# Altium schematic sheet power_ic.SchDoc
size A4; SheetNumber: 2; SheetTotal: 4
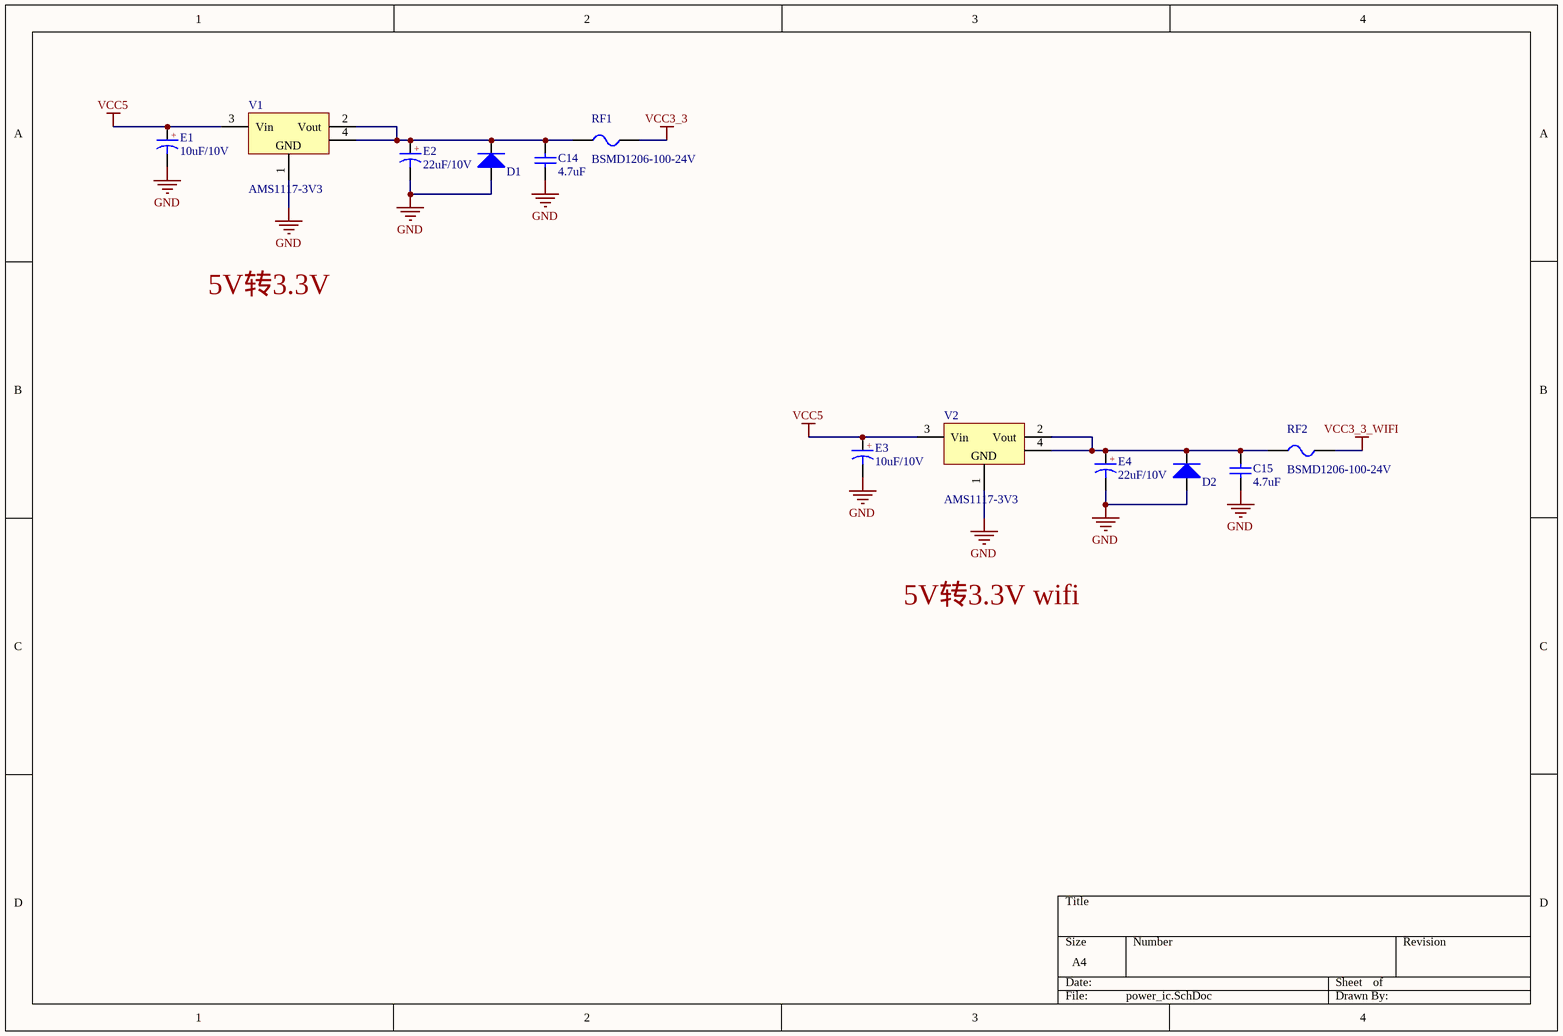
[diagram p0: power_ic.SchDoc]

## Parts
C14  4.7uF  [C0603_M]
C15  4.7uF  [C0603_M]
D1  UDD32C03L01  [SOD-323]  (value not drawn)
D2  UDD32C03L01  [SOD-323]  (value not drawn)
E1  10uF/10V  [C_3216]
E2  22uF/10V  [C_3216]
E3  10uF/10V  [C_3216]
E4  22uF/10V  [C_3216]
RF1  BSMD1206-100-24V  [F1206]
RF2  BSMD1206-100-24V  [F1206]
V1  AMS1117-3V3  [SOT223_L]
V2  AMS1117-3V3  [SOT223_L]

## Nets
GND: C14.2 C15.2 D1.1(A) D2.1(A) E1.2(K) E2.2(K) E3.2(K) E4.2(K) V1.1(GND) V2.1(GND)
VCC3_3: RF1.1
VCC3_3_WIFI: RF2.1
VCC5: E1.1(A) E3.1(A) V1.3(Vin) V2.3(Vin)
NetC14_1: C14.1 D1.2(K) E2.1(A) RF1.2 V1.2(Vout) V1.4(GND)
NetC15_1: C15.1 D2.2(K) E4.1(A) RF2.2 V2.2(Vout) V2.4(GND)

## Notes on the sheet
- 5V转3.3V
- 5V转3.3V wifi
- (in symbol CT) +

## Library data of the parts
C14 C15 = C: 贴片电容/MLCC电容; BOM名称: 无极性贴片电容; 联系下单店铺卖家 免费帮你查找封装: 联系下单店铺卖家 免费技术指导
D1 D2 = TVS: TVS通用 C78439; 当前库版本V2024.3.30 @淘宝卖家:黄晶宝石: 最新版本发布https://item.taobao.com/item.htm?id=566775463719
E1 E3 = CT: 贴片钽电容 C7171; 联系下单店铺卖家 免费帮你查找封装: 联系下单店铺卖家 免费技术指导; BOM名称: 贴片钽电容
E2 E4 = CT: 贴片钽电容  C11366; 联系下单店铺卖家 免费帮你查找封装: 联系下单店铺卖家 免费技术指导; BOM名称: 贴片钽电容
RF1 RF2 = FUSE-PPTC: PPTC自恢复保险丝 C910830; 当前库版本V2024.3.30 @淘宝卖家:黄晶宝石: 最新版本发布https://item.taobao.com/item.htm?id=566775463719; BOM名称: PPTC自恢复保险丝
  RF1: jlc_id: C910830
V1 V2 = AMS1117: 三端稳压芯片; BOM名称: 稳压芯片; 联系下单店铺卖家 免费帮你查找封装: 联系下单店铺卖家 免费技术支持; 当前库版本V2024.3.30 @淘宝卖家:黄晶宝石: 最新版本发布https://item.taobao.com/item.htm?id=566775463719